# EAGLE schematic release (EAGLE 9.0.1)
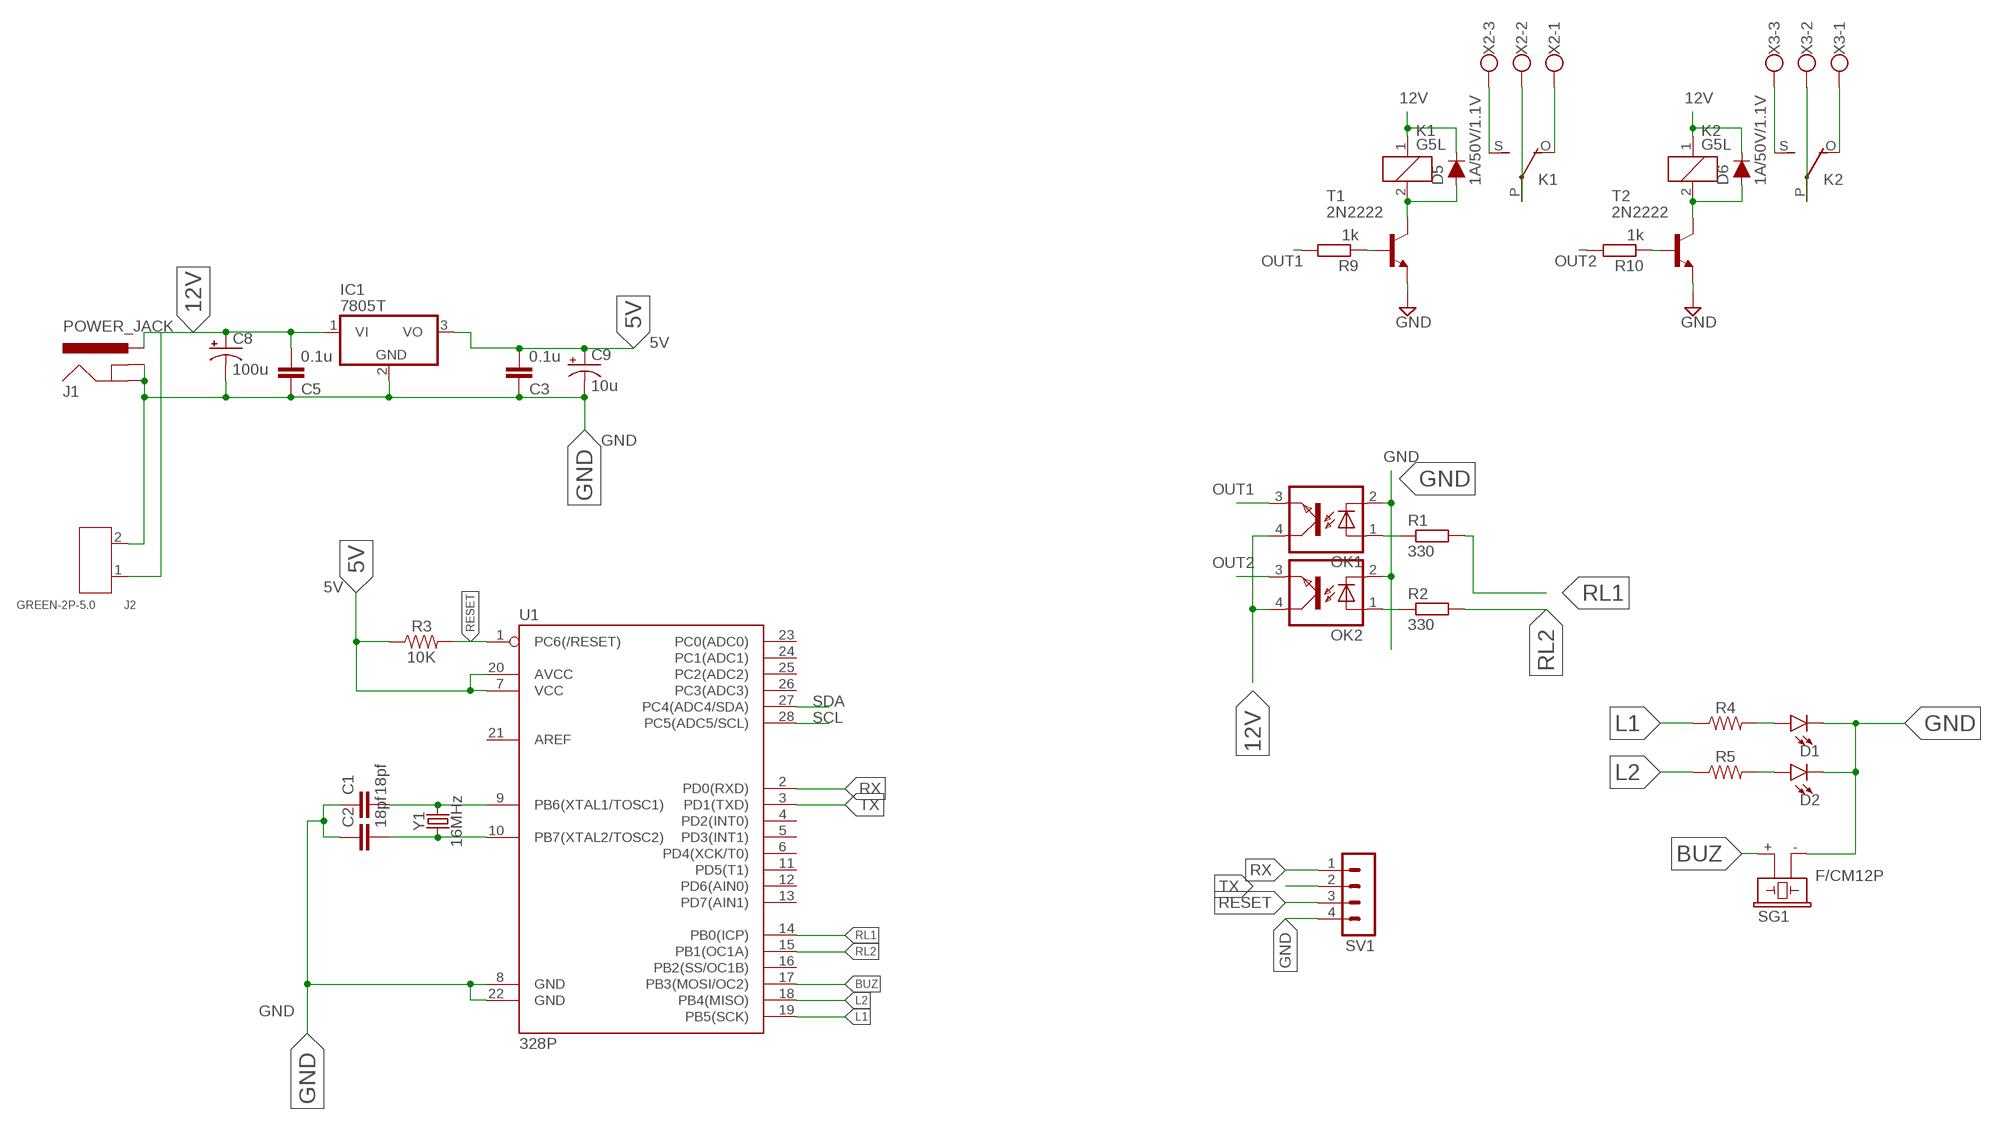
[diagram p0: schematic, sheet 1]

## Parts
C1  18pf  C2,5-3  [C2.5-3]
C2  18pf  C2,5-3  [C2.5-3]
C3  0.1u  C2,5-3  [C2.5-3]
C5  0.1u  C2,5-3  [C2.5-3]
C8  100u  CPOL-USE2.5-7  [E2,5-7]
C9  10u  CPOL-USE2.5-5  [E2,5-5]
D1  LED5MM  [LED_5MM]
D2  LED5MM  [LED_5MM]
D5  1A/50V/1.1V  DIODE-PTH  [DIODE-1N4001]
D6  1A/50V/1.1V  DIODE-PTH  [DIODE-1N4001]
IC1  7805T  [TO220H]
J1  POWER_JACK  [POWER_JACK_PTH]
J2  GREEN-2P-5.0  SCREW-TERMINAL-GREEN(2P-5.0)  [H2-5.0-10.5X8.0MM]
K1  G5L  [G5LE]
K2  G5L  [G5LE]
OK1  LTV816  [DIL04]
OK2  LTV816  [DIL04]
R1  330  R-EU_0207/7  [0207/7]
R2  330  R-EU_0207/7  [0207/7]
R3  10K  1KOHM-HORIZ-1/4W-5%  [AXIAL-0.3]
R4  RESISTORAXIAL-0.3  [AXIAL-0.3]
R5  RESISTORAXIAL-0.3  [AXIAL-0.3]
R9  1k  R-EU_0207/7  [0207/7]
R10  1k  R-EU_0207/7  [0207/7]
SG1  F/CM12P  [F/CM12P]
SV1  MA04-1  [MA04-1]
T1  2N2222  [TO92-EBC-OVAL]
T2  2N2222  [TO92-EBC-OVAL]
U1  328P  ATMEGA328P_PDIP  [DIP28]
X2  W237-103  [W237-103]
X3  W237-103  [W237-103]
Y1  16MHz  CRYSTAL-16MHZPTH-HC49US  [HC49US]

## Nets
5V: C3.2 C9.+ IC1.3(VO) R3.P$1 U1.7(VCC) U1.20(AVCC)
12V: C5.2 C8.+ D5.C D6.C IC1.1(VI) J1.PWR J2.1 K1.1 K2.1 OK1.4(COL) OK2.4(COL)
BUZ: SG1.+ U1.17(PB3(MOSI/OC2))
GND: C1.1 C2.1 C3.1 C5.1 C8.- C9.- D1.K(C) D2.K(C) IC1.2(GND) J1.GND J1.GNDBREAK J2.2 OK1.2(C) OK2.2(C) SG1.- SV1.4 T1.E T2.E U1.8(GND) U1.22(GND)
L1: R4.P$1 U1.19(PB5(SCK))
L2: R5.P$1 U1.18(PB4(MISO))
N$1: C1.2 U1.9(PB6(XTAL1/TOSC1)) Y1.2
N$2: C2.2 U1.10(PB7(XTAL2/TOSC2)) Y1.1
N$3: OK1.1(A) R1.1
N$4: OK2.1(A) R2.1
N$6: R9.1 T1.B
N$7: D1.A R4.P$2
N$8: D2.A R5.P$2
N$18: K1.S(2:S) X2.3
N$21: K1.O(2:O) X2.1
N$22: K1.P(2:P) X2.2
N$23: D5.A K1.2 T1.C
N$26: R10.1 T2.B
N$27: K2.S(2:S) X3.3
N$28: K2.O(2:O) X3.1
N$29: K2.P(2:P) X3.2
N$30: D6.A K2.2 T2.C
OUT1: OK1.3(EMIT) R9.2
OUT2: OK2.3(EMIT) R10.2
RESET: R3.P$2 SV1.3 U1.1(PC6(/RESET))
RL1: R1.2 U1.14(PB0(ICP))
RL2: R2.2 U1.15(PB1(OC1A))
RX: SV1.1 U1.2(PD0(RXD))
SCL: U1.28(PC5(ADC5/SCL))
SDA: U1.27(PC4(ADC4/SDA))
TX: SV1.2 U1.3(PD1(TXD))
Unconnected: U1.4(PD2(INT0)) U1.5(PD3(INT1)) U1.6(PD4(XCK/T0)) U1.11(PD5(T1)) U1.12(PD6(AIN0)) U1.13(PD7(AIN1)) U1.16(PB2(SS/OC1B)) U1.21(AREF) U1.23(PC0(ADC0)) U1.24(PC1(ADC1)) U1.25(PC2(ADC2)) U1.26(PC3(ADC3))

## Library data of the parts
C1-C3 C5 = capacitor-wima:C: CAPACITOR naming: grid - package width
C8 C9 = adafruit:CPOL-US: POLARIZED CAPACITOR, American symbol
D1 D2 = SparkFun-LED:LED: LED (Generic) Standard schematic elements and footprints for 5mm, 3mm, 1206, and 0603 sized LEDs. Generic LEDs with no color specified.
D5 D6 = SparkFun-DiscreteSemi:DIODE: Diode These are standard reverse protection diodes and small signal diodes. SparkFun Products: SparkFun SparkPunk Sound Kit <https://www.sparkfun.com/products/11177> SparkFun ESP8266 Thing <https://www.sparkfun.com/products/13231>; PROD_ID: DIO-09176
IC1 = adafruit:78*: Positive VOLTAGE REGULATOR Added bigger pads to the TO-92 package
J1 = SparkFun-Connectors:POWER_JACK: Power Jack Connector This is the standard 5.5mm barrel jack for power. The PTH is the most common, proven, reliable, footprint. The Slot footprint only works if the mill layer is transmitted to the PCB fab house so be warned. Here are the connectors we sell at SparkFun: DC Barrel Power Jack/Connector <https://www.sparkfun.com/products/119> (PRT-00119) DC Barrel Power Jack/Connector (SMD) <https://www.sparkfun.com/products/12748> (PRT-12748) DC Barrel Jack Adapter - Breadboard Compatible <https://www.sparkfun.com/products/10811> (PRT-10811) It is used on this SparkFun product (and many, many others): SparkFun RedBoard - Programmed with Arduino <https://www.sparkfun.com/products/12757> (DEV-12757) Also, if you need a mating power supply or connector, please check these out: Wall Adapter Power Supply - 9VDC 650mA <https://www.sparkfun.com/products/298> (TOL-00298) DC Barrel Jack Adapter - Male <https://www.sparkfun.com/products/10287> (PRT-10287); PROD_ID: CONN-08197
J2 = Seeed-Connector:SCREW-TERMINAL-GREEN(2P-5.0): 320110031
K1 K2 = relay:G5L: RELAY 1 x switch, 10 A/120 V AC, 8 A/30 V ADC, Omron; OC_FARNELL: unknown; OC_NEWARK: unknown
OK1 OK2 = optocoupler:LTV816: OPTO COUPLER Source: LITEON, LTV816.pdf; OC_FARNELL: unknown; OC_NEWARK: unknown
R1 R2 = Clean-Kong:R-EU_: RESISTOR, European symbol
R3 = SparkFun-Resistors:1KOHM: 1kΩ resistor A resistor is a passive two-terminal electrical component that implements electrical resistance as a circuit element. Resistors act to reduce current flow, and, at the same time, act to lower voltage levels within circuits. - Wikipedia; PROD_ID: RES-08380; VALUE: 1k
R4 R5 = SparkFun-Resistors:RESISTOR: Generic Resistor Package
R9 R10 = resistor:R-EU_: RESISTOR, European symbol
SG1 = buzzer:F/CM12P: BUZZER Source: Buerklin; OC_FARNELL: unknown; OC_NEWARK: unknown
SV1 = con-lstb:MA04-1: PIN HEADER; OC_FARNELL: unknown; OC_NEWARK: unknown
T1 T2 = adafruit:2N2222: NPN TRANSISTOR Big oval pads
U1 = SparkFun-IC-Microcontroller:ATMEGA328P_PDIP: Atmel 328P Through hole ATMEGA328P uC used in the Arduino 32kb flash, 1k EEPROM, 2k SRAM Datasheet <http://www.sparkfun.com/datasheets/Components/SMD/ATMega328.pdf> SparkFun Products Storefront component: AVR 28 Pin 20MHz 32K 6A/D - ATMega328P <https://www.sparkfun.com/products/9061> (COM-09061) SparkFun Simon Says - Through-Hole Soldering Kit <https://www.sparkfun.com/products/10547> (KIT-10547) SparkFun Learn to Solder - Simon Says <https://www.sparkfun.com/products/13708> (KIT-13708) SparkFun BigTime Watch Kit <https://www.sparkfun.com/products/11734> (KIT-11734) SparkFun ClockIt <https://www.sparkfun.com/products/10930> (KIT-10930) SparkFun Serial Enabled LCD Kit <https://www.sparkfun.com/products/10097> (LCD-10097) SparkFun Simon Tilts - Through Hole Soldering Kit <https://www.sparkfun.com/products/12634> (KIT-12634) SparkFun Frequency Counter Kit <https://www.sparkfun.com/products/10140> (KIT-10140) FabFM Radio Kit <https://www.sparkfun.com/products/11043> (KIT-11043) SparkFun Binary Blaster Kit <https://www.sparkfun.com/products/12037> (KIT-12037) SparkFun Metro-Gnome <https://www.sparkfun.com/products/9236> (KIT-09236) ATmega328 with Arduino Optiboot (Uno) <https://www.sparkfun.com/products/10524> (DEV-10524); PROD_ID: IC-09136
X2 X3 = con-wago-500:W237-103: WAGO SCREW CLAMP; MPN: 237-103; OC_FARNELL: unknown; OC_NEWARK: 18M7116
Y1 = SparkFun-Clocks:CRYSTAL-16MHZ: 16MHz Crystal Digikey Example <http://www.digikey.com/product-search/en?keywords=535-9122-1-ND> Frequency: 16MHz Frequency Stability: ±50ppm Frequency Tolerance: ±20ppm Load Capacitance: 18pF SparkFun Products: Pro Micro -5V/16MHz <https://www.sparkfun.com/products/12640> SparkFun Serial Enabled LCD Kit <https://www.sparkfun.com/products/10097>; PROD_ID: XTAL-08181; SF_ID: COM-00536